# EAGLE design siggen (EAGLE 7.3.0)
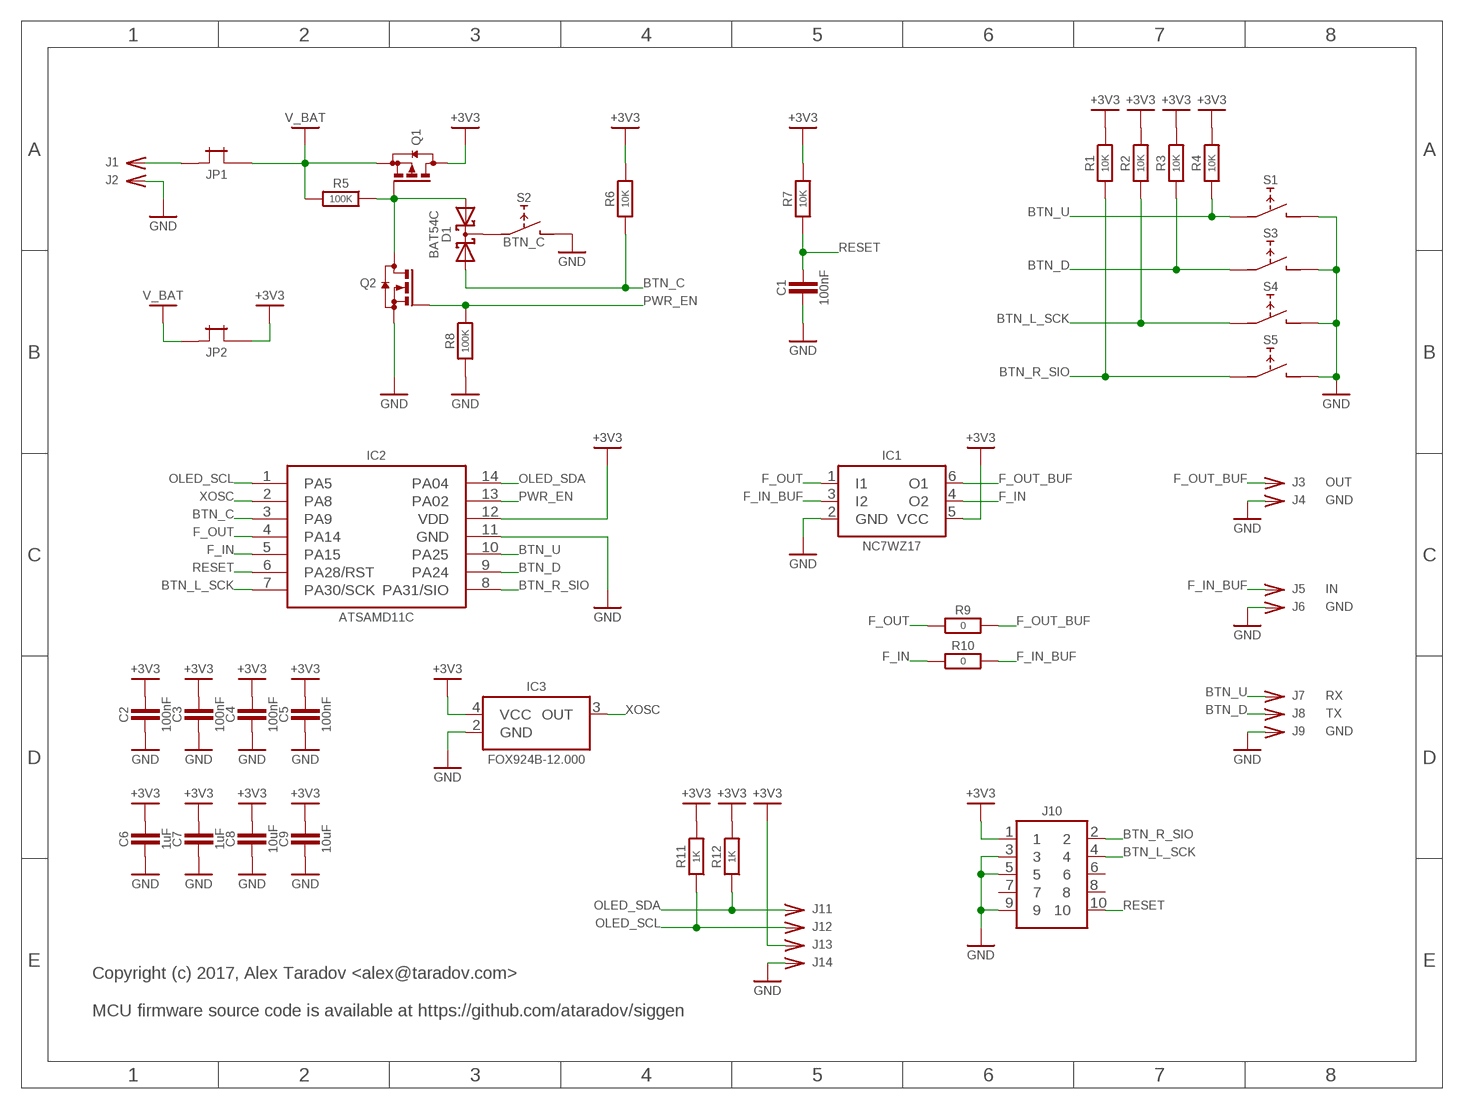
[diagram p0: schematic, sheet 1]

## Parts
C1  100nF  C-0603  [SMD0603]
C2  100nF  C-0603  [SMD0603]
C3  100nF  C-0603  [SMD0603]
C4  100nF  C-0603  [SMD0603]
C5  100nF  C-0603  [SMD0603]
C6  1uF  C-0603  [SMD0603]
C7  1uF  C-0603  [SMD0603]
C8  10uF  C-0805  [SMD0805]
C9  10uF  C-0805  [SMD0805]
D1  BAT54C  [SOT23]
IC1  NC7WZ17  [SC70]
IC2  ATSAMD11C  [SO-14]
IC3  FOX924B-12.000  OSC-CTS406  [CTS406]
J1  CONN-SINGLE-TH  [PIN-TH]
J2  CONN-SINGLE-TH  [PIN-TH]
J3  OUT  CONN-SINGLE-TH  [PIN-TH]
J4  GND  CONN-SINGLE-TH  [PIN-TH]
J5  IN  CONN-SINGLE-TH  [PIN-TH]
J6  GND  CONN-SINGLE-TH  [PIN-TH]
J7  RX  CONN-SINGLE-TH  [PIN-TH]
J8  TX  CONN-SINGLE-TH  [PIN-TH]
J9  GND  CONN-SINGLE-TH  [PIN-TH]
J10  HEADER-5X2-TH-1.27  [HEADER-5X2-1.27MM]
J11  CONN-SINGLE-TH  [PIN-TH]
J12  CONN-SINGLE-TH  [PIN-TH]
J13  CONN-SINGLE-TH  [PIN-TH]
J14  CONN-SINGLE-TH  [PIN-TH]
JP1  JUMPER-TH-TH  [JUMPER-TH]
JP2  JUMPER-TH-TH  [JUMPER-TH]
Q1  P-MOSFET  [SOT23]
Q2  N-MOSFET  [SOT23]
R1  10K  R-0603  [SMD0603]
R2  10K  R-0603  [SMD0603]
R3  10K  R-0603  [SMD0603]
R4  10K  R-0603  [SMD0603]
R5  100K  R-0603  [SMD0603]
R6  10K  R-0603  [SMD0603]
R7  10K  R-0603  [SMD0603]
R8  100K  R-0603  [SMD0603]
R9  0  R-0603  [SMD0603]
R10  0  R-0603  [SMD0603]
R11  1K  R-0603  [SMD0603]
R12  1K  R-0603  [SMD0603]
S1  TACT_SWITCH_6MM-SMD  [TACT-SMD-6MM]
S2  BTN_C  TACT_SWITCH_6MM-SMD  [TACT-SMD-6MM]
S3  TACT_SWITCH_6MM-SMD  [TACT-SMD-6MM]
S4  TACT_SWITCH_6MM-SMD  [TACT-SMD-6MM]
S5  TACT_SWITCH_6MM-SMD  [TACT-SMD-6MM]

## Nets
+3V3: C2.2 C3.2 C4.2 C5.2 C6.2 C7.2 C8.2 C9.2 IC1.5(VCC) IC2.12(VDD) IC3.4(VCC) J10.1 J13.1 JP2.2 Q1.3(D) R1.2 R2.2 R3.2 R4.2 R6.2 R7.2 R11.2 R12.2
BTN_C: D1.1(A1) IC2.3(PA9) R6.1
BTN_D: IC2.9(PA24) J8.1 R3.1 S3.1 S3.2
BTN_L_SCK: IC2.7(PA30/SCK) J10.4 R2.1 S4.1 S4.2
BTN_R_SIO: IC2.8(PA31/SIO) J10.2 R1.1 S5.1 S5.2
BTN_U: IC2.10(PA25) J7.1 R4.1 S1.1 S1.2
F_IN: IC1.4(O2) IC2.5(PA15) R10.1
F_IN_BUF: IC1.3(I2) J5.1 R10.2
F_OUT: IC1.1(I1) IC2.4(PA14) R9.1
F_OUT_BUF: IC1.6(O1) J3.1 R9.2
GND: C1.1 C2.1 C3.1 C4.1 C5.1 C6.1 C7.1 C8.1 C9.1 IC1.2(GND) IC2.11(GND) IC3.2(GND) J2.1 J4.1 J6.1 J9.1 J10.3 J10.5 J10.9 J14.1 Q2.2(S) R8.1 S1.3 S1.4 S2.3 S2.4 S3.3 S3.4 S4.3 S4.4 S5.3 S5.4
N$1: D1.2(A2) Q1.1(G) Q2.3(D) R5.2
N$2: D1.3(CC) S2.1 S2.2
N$3: J1.1 JP1.1
OLED_SCL: IC2.1(PA5) J12.1 R11.1
OLED_SDA: IC2.14(PA04) J11.1 R12.1
PWR_EN: IC2.13(PA02) Q2.1(G) R8.2
RESET: C1.2 IC2.6(PA28/RST) J10.10 R7.1
V_BAT: JP1.2 JP2.1 Q1.2(S) R5.1
XOSC: IC2.2(PA8) IC3.3(OUT)
Unconnected: J10.6 J10.7 J10.8

## Notes on the sheet
- Copyright (c) 2017, Alex Taradov <alex@taradov.com>
  
  MCU firmware source code is available at https://github.com/ataradov/siggen

## Library data of the parts
C1-C9 = ataradov_rlc:C
D1 = ataradov_semi:BAT54C: BAT54C
IC1 = ataradov_ic:NC7WZ17
IC2 = ataradov_mcu:ATSAMD11C
IC3 = ataradov_crystal:OSC: Generic oscillator
J1-J9 J11-J14 = ataradov_conn:CONN-SINGLE
J10 = ataradov_conn:HEADER-5X2
JP1 JP2 = ataradov_conn:JUMPER-TH
Q1 = ataradov_semi:P-MOSFET: N-CHANNEL Small Signal MOSFET
Q2 = ataradov_semi:N-MOSFET: N-CHANNEL Small Signal MOSFET
R1-R12 = ataradov_rlc:R
S1-S5 = ataradov_switch:TACT_SWITCH_6MM

## Board
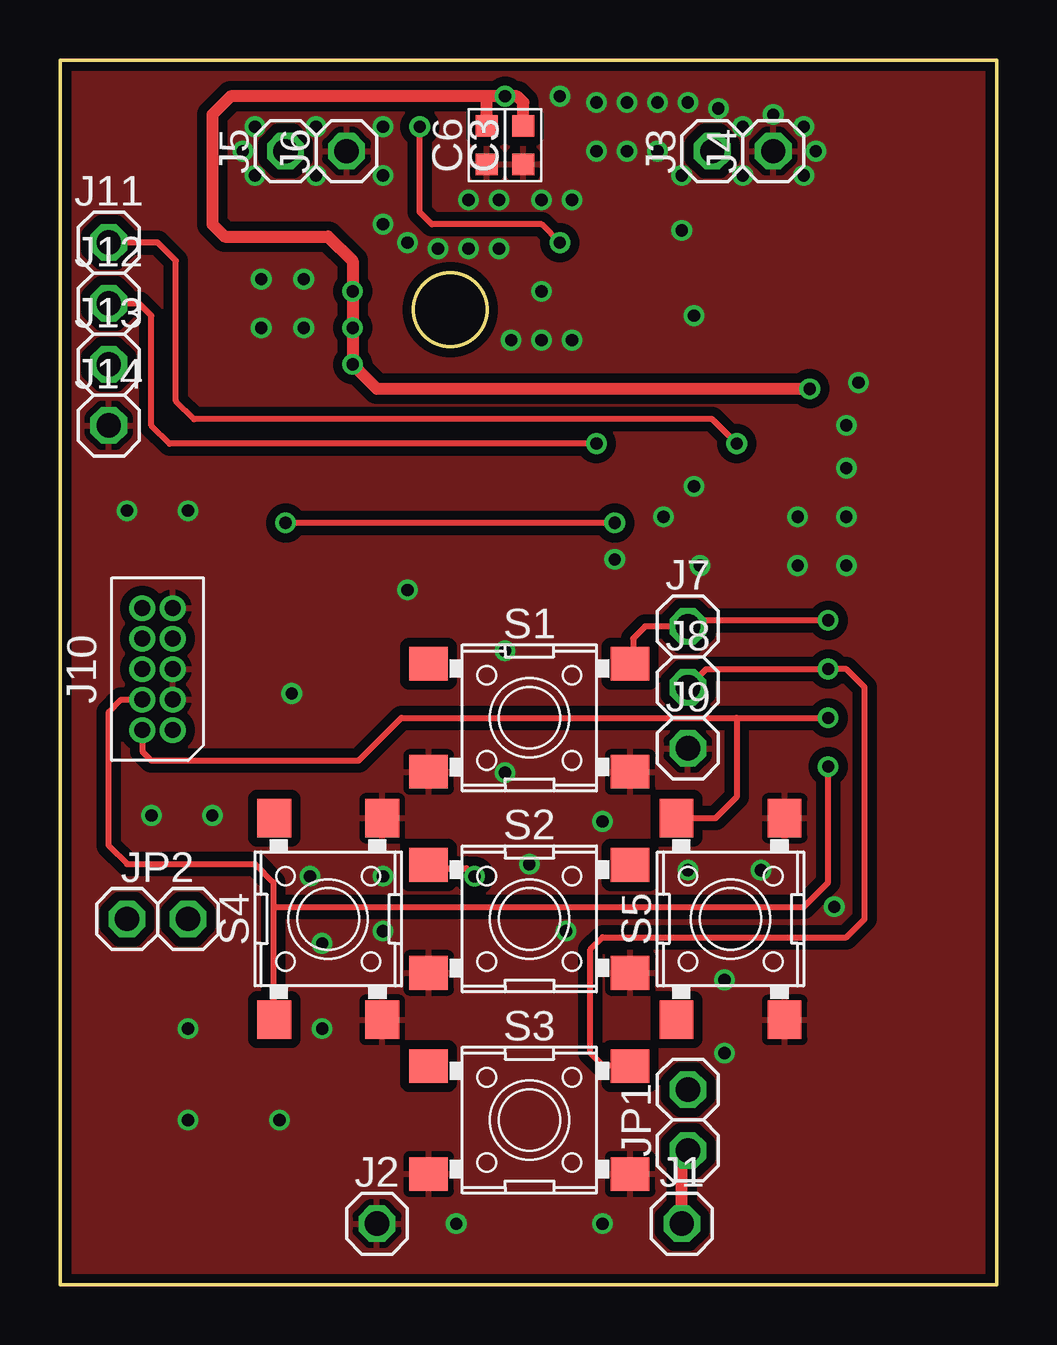
[diagram p1: board, top side]
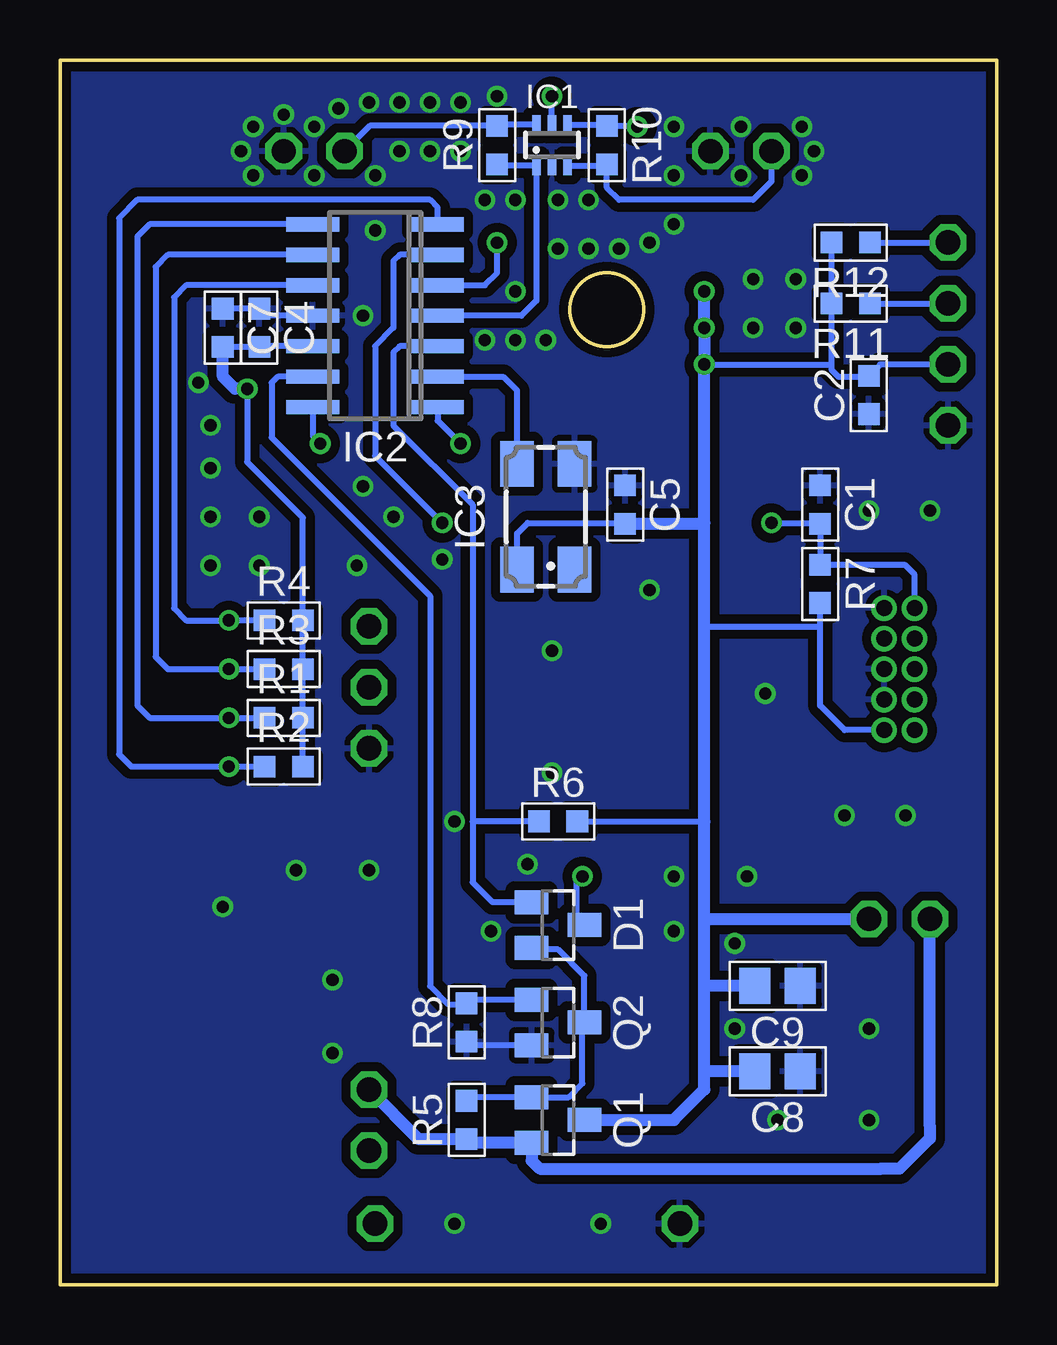
[diagram p2: board, bottom side, seen from below]

Size 39.04 x 51.04 mm. Coordinates in mm from the lower left corner, seen from the top.
Outline: 0,0 39.04,0 39.04,51.04 0,51.04 0,0
Outline: circle at 16.26,40.64 radius 1.52
Copper layers (1*16): Top 0.0356mm / dielectric 1.5011mm / Bottom 0.0356mm
Design rules "OSHPark": minimum track width 6mil, minimum drill 13mil, track to track 6mil, track to pad 6mil, pad to pad 6mil, via to via 6mil, smd to smd 6mil, copper to edge 15mil, drill to drill 6mil, minimum pad ring 7mil, minimum via ring 7mil, stop-mask expansion 3mil, vias tented up to drill 0mil, thermal gap 10mil

### Footprints (pad centres in the part's own frame; a part is rotated, then mirrored left to right if it is on the bottom)
SMD0603 = smd 0.9 x 0.9: 1 -0.8,0; 2 0.8,0
SMD0805 = smd 1.3 x 1.5: 1 -0.95,0; 2 0.95,0
SOT23 = smd 1 x 1.4: 1 -0.95,-1.1; 2 0.95,-1.1; 3 0,1.1
SC70 = smd 0.35 x 0.8: 1 -0.65,-0.85; 2 0,-0.85; 3 0.65,-0.85; 4 0.65,0.85; 5 0,0.85; 6 -0.65,0.85
SO-14 = smd 0.6 x 2.2: 1 -3.81,-2.6; 2 -2.54,-2.6; 3 -1.27,-2.6; 4 0,-2.6; 5 1.27,-2.6; 6 2.54,-2.6; 7 3.81,-2.6; 8 3.81,2.6; 9 2.54,2.6; 10 1.27,2.6; 11 0,2.6; 12 -1.27,2.6; 13 -2.54,2.6; 14 -3.81,2.6
CTS406 = smd 1.9 x 1.4: 1 -2.2,-1.2; 2 2.2,-1.2; 3 2.2,1.2; 4 -2.2,1.2
PIN-TH = drill 1.016 octagon: 1 0,0
HEADER-5X2-1.27MM = drill 0.66 pad 1.067: 1 -2.54,-0.635; 2 -2.54,0.635; 3 -1.27,-0.635; 4 -1.27,0.635; 5 0,-0.635; 6 0,0.635; 7 1.27,-0.635; 8 1.27,0.635; 9 2.54,-0.635; 10 2.54,0.635
JUMPER-TH = drill 1.016 octagon: 1 -1.27,0; 2 1.27,0
TACT-SMD-6MM = smd 1.6 x 1.4: 1 -4.2,2.25; 2 4.2,2.25; 3 -4.2,-2.25; 4 4.2,-2.25

### Placement (x,y rotation side)
C1  7.37,32.51 270 bottom
C2  5.33,37.08 90 bottom
C3  19.3,47.5 90 top
C4  30.73,39.88 270 bottom
C5  15.49,32.51 270 bottom
C6  17.78,47.5 90 top
C7  32.26,39.88 270 bottom
C8  9.14,8.89 180 bottom
C9  9.14,12.45 180 bottom
D1  18.29,14.99 270 bottom
IC1  18.54,47.5 0 bottom
IC2  25.91,40.39 90 bottom
IC3  18.8,32 90 bottom
J1  25.91,2.54 0 top
J2  13.21,2.54 0 top
J3  27.18,47.24 90 top
J4  29.72,47.24 90 top
J5  9.4,47.24 90 top
J6  11.94,47.24 90 top
J7  26.16,27.43 0 top
J8  26.16,24.89 0 top
J9  26.16,22.35 0 top
J10  4.06,25.65 90 top
J11  2.03,43.43 0 top
J12  2.03,40.89 0 top
J13  2.03,38.35 0 top
J14  2.03,35.81 0 top
JP1  26.16,6.86 90 top
JP2  4.06,15.24 0 top
Q1  18.29,6.86 270 bottom
Q2  18.29,10.92 270 bottom
R1  29.72,23.62 0 bottom
R2  29.72,21.59 0 bottom
R3  29.72,25.65 0 bottom
R4  29.72,27.69 0 bottom
R5  22.1,6.86 90 bottom
R6  18.29,19.3 0 bottom
R7  7.37,29.21 270 bottom
R8  22.1,10.92 90 bottom
R9  20.83,47.5 90 bottom
R10  16.26,47.5 270 bottom
R11  6.1,40.89 180 bottom
R12  6.1,43.43 180 bottom
S1  19.56,23.62 0 top
S2  19.56,15.24 0 top
S3  19.56,6.86 0 top
S4  11.18,15.24 90 top
S5  27.94,15.24 90 top

### Tracks (layer width: path | path; a pad name or v marks a point on that pad's centre or on a via)
+3V3  (via drill 0.51 pad 0.86)
  Top 0.508: 17.78,49.53 v18.54,49.53 19.05,49.53 19.3,49.28 C3.2 | v31.24,37.34 13.21,37.34 v12.19,38.35 12.19,42.67 11.18,43.69 6.86,43.69 6.35,44.2 6.35,48.77 7.11,49.53 17.78,49.53 | C6.2 17.78,49.53
  Bottom 0.254: IC1.5 v18.54,49.53 | IC2.12 30.44,39.12 C4.2 C7.2 | J13.1 4.86,38.35 C2.2 5.37,37.85 6.6,37.85 6.9,38.14 6.9,38.35 | R12.2 R11.2 6.9,38.35 | v12.19,38.35 6.9,38.35 | J10.1 6.35,23.11 7.37,24.13 7.37,27.43 | 7.37,27.43 R7.2 7.4,28.45 | 12.19,27.43 7.37,27.43 | IC3.4 20,31.31 19.56,31.75 15.79,31.75 C5.2 | 12.23,31.71 12.19,31.75 | R6.2 12.19,19.3 | v31.24,37.34 31.24,34.29 28.92,31.97 R4.2 R3.2 R1.2 R2.2
  Bottom 0.508: Q1.3 13.46,6.86 12.19,8.13 12.19,8.89 | 12.19,8.89 12.19,12.45 | 12.19,12.45 12.19,15.24 | 12.19,15.24 JP2.2 | v31.24,37.34 31.75,37.34 32.26,37.85 C7.2 | C9.2 12.19,12.45 | C8.2 12.19,8.89 | 12.19,15.24 12.19,19.3 12.19,27.43 12.19,31.75 v12.19,38.35 v12.19,39.88 v12.19,41.4 | C5.2 12.23,31.71
BTN_C
  Bottom 0.254: IC2.3 24.89,39.12 25.15,38.86 25.15,35.81 21.84,32.51 21.84,19.3 | 21.84,19.3 21.84,16.76 21.02,15.94 D1.1 | R6.1 21.84,19.3
BTN_D  (via drill 0.51 pad 0.86)
  Top 0.254: S3.2 22.64,9.11 22.1,9.65 22.1,13.97 22.61,14.48 32.77,14.48 33.53,15.24 33.53,24.89 32.77,25.65 v32,25.65 26.92,25.65 J8.1
  Bottom 0.254: IC2.9 34.54,42.93 35.05,42.42 35.05,26.16 34.54,25.65 v32,25.65 R3.1
BTN_L_SCK  (via drill 0.51 pad 0.86)
  Top 0.254: J10.4 2.54,24.38 2.03,23.88 2.03,18.29 2.79,17.53 8.13,17.53 8.89,16.76 8.89,15.75 | 8.89,15.75 8.89,11.08 S4.1 | 8.89,15.75 30.99,15.75 32,16.76 v32,21.59
  Bottom 0.254: IC2.7 23.31,44.9 23.62,45.21 35.81,45.21 36.58,44.45 36.58,22.1 36.07,21.59 v32,21.59 R2.1
BTN_R_SIO  (via drill 0.51 pad 0.86)
  Top 0.254: J10.2 3.43,22.23 3.81,21.84 12.45,21.84 14.22,23.62 28.19,23.62 | 28.19,23.62 v32,23.62 | S5.2 27.31,19.44 28.19,20.32 28.19,23.62
  Bottom 0.254: IC2.8 35.31,44.2 35.81,43.69 35.81,24.13 35.31,23.62 v32,23.62 R1.1
BTN_U  (via drill 0.51 pad 0.86)
  Top 0.254: 23.79,25.91 S1.2 23.88,25.99 23.88,26.92 24.38,27.43 J7.1 26.42,27.69 v32,27.69
  Bottom 0.254: IC2.10 33.78,41.66 34.29,41.15 34.29,28.19 33.78,27.69 v32,27.69 R4.1
F_IN  (via drill 0.51 pad 0.86)
  Top 0.254: v20.83,43.43 20.07,44.2 15.49,44.2 14.99,44.7 v14.99,48.26
  Bottom 0.254: IC1.4 16.31,48.35 R10.1 15.28,48.3 v14.99,48.26 | IC2.5 21.34,41.66 20.83,42.16 v20.83,43.43
F_IN_BUF
  Bottom 0.254: J5.1 9.4,45.97 10.16,45.21 15.75,45.21 16.26,45.72 R10.2 16.31,46.65 IC1.3
F_OUT
  Bottom 0.254: R9.1 20.78,46.65 IC1.1 19.19,41.01 19.81,40.39 IC2.4
F_OUT_BUF
  Bottom 0.254: IC1.6 20.78,48.35 R9.2 26.12,48.3 J3.1
GND  (via drill 0.51 pad 0.86)
  Bottom 0.254: Q2.2 21.95,9.97 R8.1 | IC2.11 30.44,40.39 C4.1 C7.1
  other vias: 32.77,32 33.27,37.59 32.77,35.81 32.77,34.04 26.67,29.97 30.73,32 32.77,29.97 30.73,29.97 22.35,47.24 23.62,47.24 24.89,47.24 22.35,49.28 23.62,49.28 24.89,49.28 26.16,49.28 27.43,49.02 28.45,48.26 25.91,46.23 29.72,48.77 30.99,48.26 31.5,47.24 7.62,47.24 30.99,46.23 28.45,46.23 10.67,48.26 10.67,46.23 13.46,46.23 13.46,48.26 8.13,48.26 8.13,46.23 18.29,45.21 20.07,45.21 20.07,41.4 18.29,43.18 21.34,39.37 18.8,39.37 8.38,41.91 10.16,41.91 10.16,39.88 8.38,39.88 20.83,49.53 20.07,39.37 17.02,45.21 17.02,43.18 15.75,43.18 14.48,43.43 13.46,44.2 21.34,45.21 5.33,32.26 2.79,32.26 18.54,26.42 18.54,21.34 9.65,24.64 5.33,10.67 9.14,6.86 5.33,6.86 26.16,17.27 29.21,17.27 27.69,12.7 27.69,9.65 25.91,43.94 3.81,19.56 6.35,19.56 19.56,17.53 23.11,30.23 22.61,19.3 14.48,28.96 16.51,2.54 22.61,2.54 32.26,15.75 25.15,32 26.42,33.27 26.42,40.39 21.08,14.73 13.46,14.73 13.46,17.02 10.41,17.02 10.92,14.22 10.92,10.67
  pour Top (isolate 0.381): 0,0 39.12,0 39.12,51.05 0,51.05
  pour Bottom (isolate 0.381): 0,0 39.12,0 39.12,51.05 0,51.05
N$1
  Bottom 0.254: R5.2 21.95,7.81 Q1.1 17.85,7.81 17.27,8.38 17.27,10.84 Q2.3 17.19,12.87 18.29,13.97 19.32,13.97 D1.2
N$2  (via drill 0.51 pad 0.86)
  Top 0.254: S2.1 15.49,17.35 16.94,17.35 v17.27,17.02
  Bottom 0.254: v17.27,17.02 17.53,16.76 17.53,15.32 D1.3
N$3
  Top 0.508: J1.1 25.91,5.33 JP1.1
OLED_SCL  (via drill 0.51 pad 0.86)
  Top 0.254: v22.35,35.05 4.57,35.05 3.81,35.81 3.81,40.39 3.3,40.89 J12.1
  Bottom 0.254: IC2.1 23.31,36.01 v22.35,35.05 | R11.1 J12.1
OLED_SDA  (via drill 0.51 pad 0.86)
  Top 0.254: v28.19,35.05 27.18,36.07 5.59,36.07 4.83,36.83 4.83,42.67 4.06,43.43 J11.1
  Bottom 0.254: IC2.14 28.51,35.37 v28.19,35.05 | R12.1 J11.1
PWR_EN
  Bottom 0.254: Q2.1 21.95,11.87 R8.2 22.14,11.68 22.86,11.68 23.62,12.45 23.62,28.7 30.23,35.31 30.23,37.59 29.97,37.85 IC2.13
RESET  (via drill 0.51 pad 0.86)
  Top 0.254: v23.11,31.75 v9.4,31.75
  Bottom 0.254: IC2.6 24.89,42.93 25.15,42.67 25.15,39.88 25.91,39.12 25.91,34.54 v23.11,31.75 | v9.4,31.75 7.4,31.75 C1.2 R7.1 3.85,30.01 3.43,29.59 J10.10
V_BAT
  Bottom 0.254: 21.95,5.91 R5.1
  Bottom 0.508: 21.95,5.91 Q1.2 19.39,5.16 19.05,4.83 4.83,4.83 4.06,4.83 2.79,6.1 2.79,6.6 JP2.1 | R5.1 24.09,6.06 JP1.2
XOSC
  Bottom 0.254: IC2.2 20.57,37.85 20,37.27 IC3.3

### Text on the board
tValues: 1 | SWBP | CM | - | +
bValues: AT | 4/23/17